# Altium schematic sheet SelfDrivingCar_System_Diagram.SchDoc
size A; DocumentNumber: 2; SheetNumber: 1; SheetTotal: 7
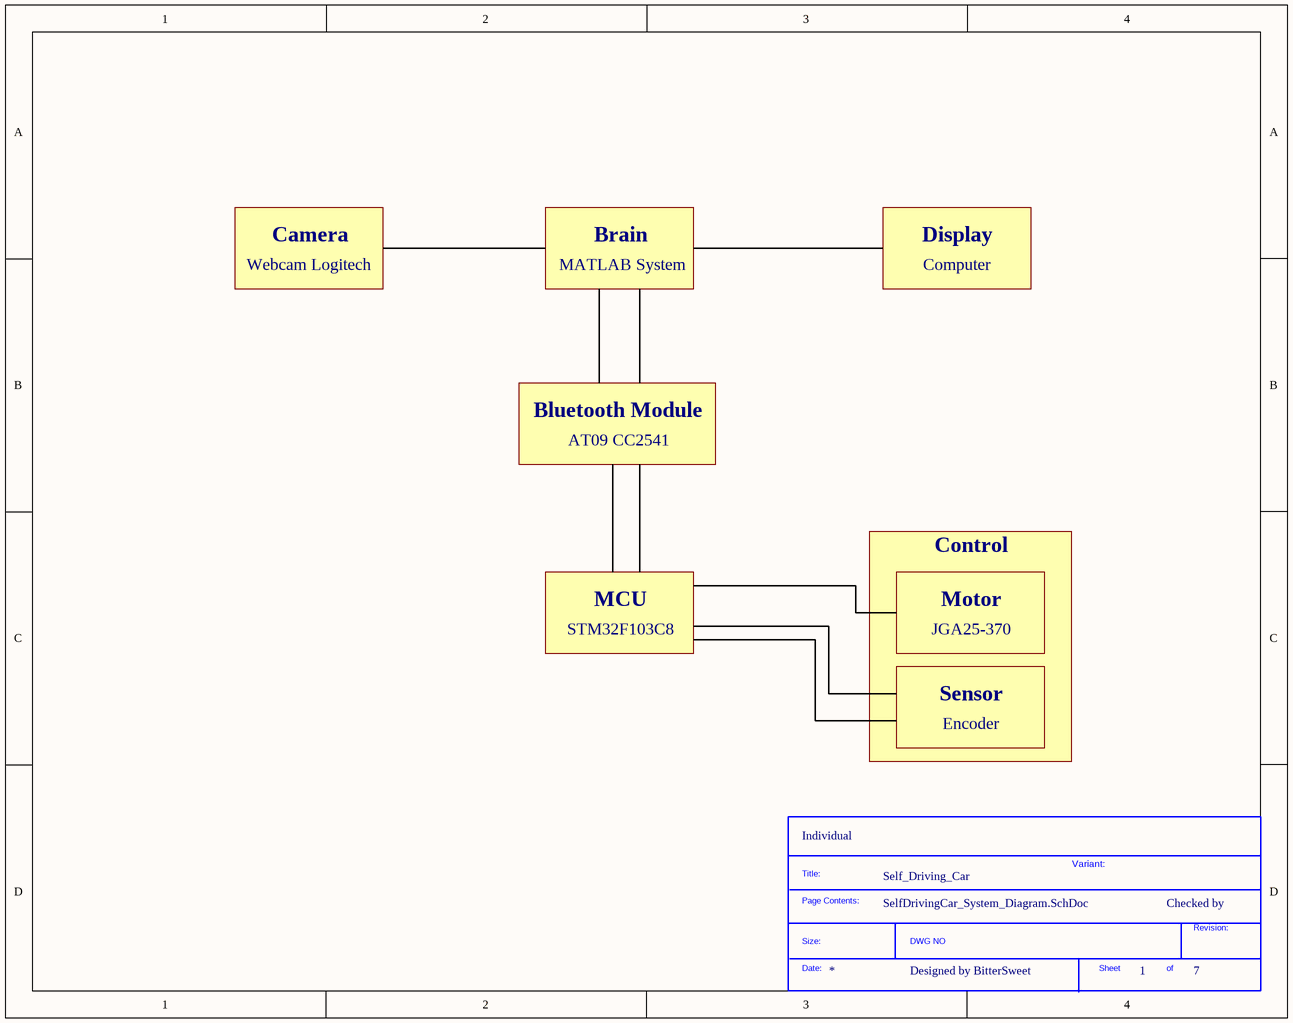
[diagram p0: SelfDrivingCar_System_Diagram.SchDoc]

## Parts
*?  SDTitleBlock  (value not drawn)  (graphical)

## Notes on the sheet
- Webcam Logitech
- Camera
- MATLAB System
- Brain
- Display
- Computer
- Bluetooth Module
- AT09 CC2541
- Control
- STM32F103C8
- MCU
- JGA25-370
- Motor
- Sensor
- Encoder
- (near *?) Individual
- Self_Driving_Car
- Variant:
- Checked by
- Designed by BitterSweet
- (in symbol SDTitleBlock) Title:; Page Contents:; Revision:; Size:; DWG NO; Date:; Sheet; of